# Altium schematic sheet 01_4G模块测试板结构图.SchDoc
size A4
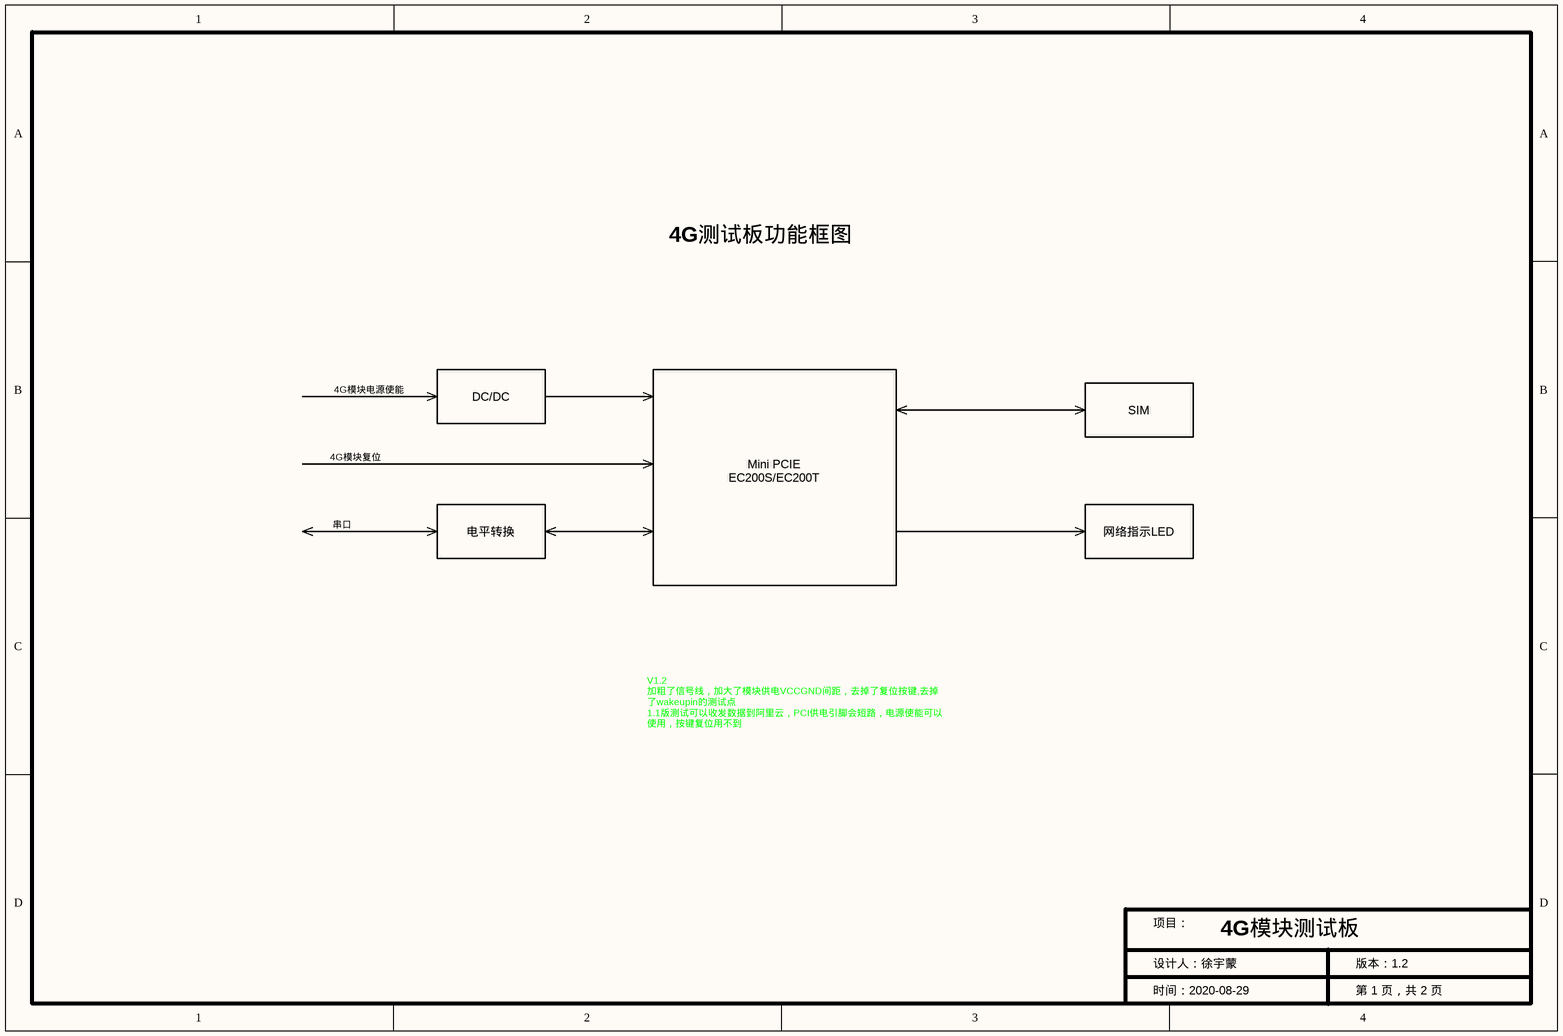
[diagram p0: 01_4G模块测试板结构图.SchDoc]

## Notes on the sheet
- 4G测试板功能框图
- 4G模块电源使能
- DC/DC
- SIM
- 4G模块复位
- Mini PCIE
- EC200S/EC200T
- 串口
- 电平转换
- 网络指示LED
- V1.2
  加粗了信号线，加大了模块供电VCCGND间距，去掉了复位按键,去掉了wakeupin的测试点
  1.1版测试可以收发数据到阿里云，PCI供电引脚会短路，电源使能可以使用，按键复位用不到
- 项目：
- 4G模块测试板
- 设计人：徐宇蒙
- 时间：2020-08-29
- 第 1 页，共 2 页
- 版本：1.2